# EAGLE design adapter (EAGLE 9.6.2)
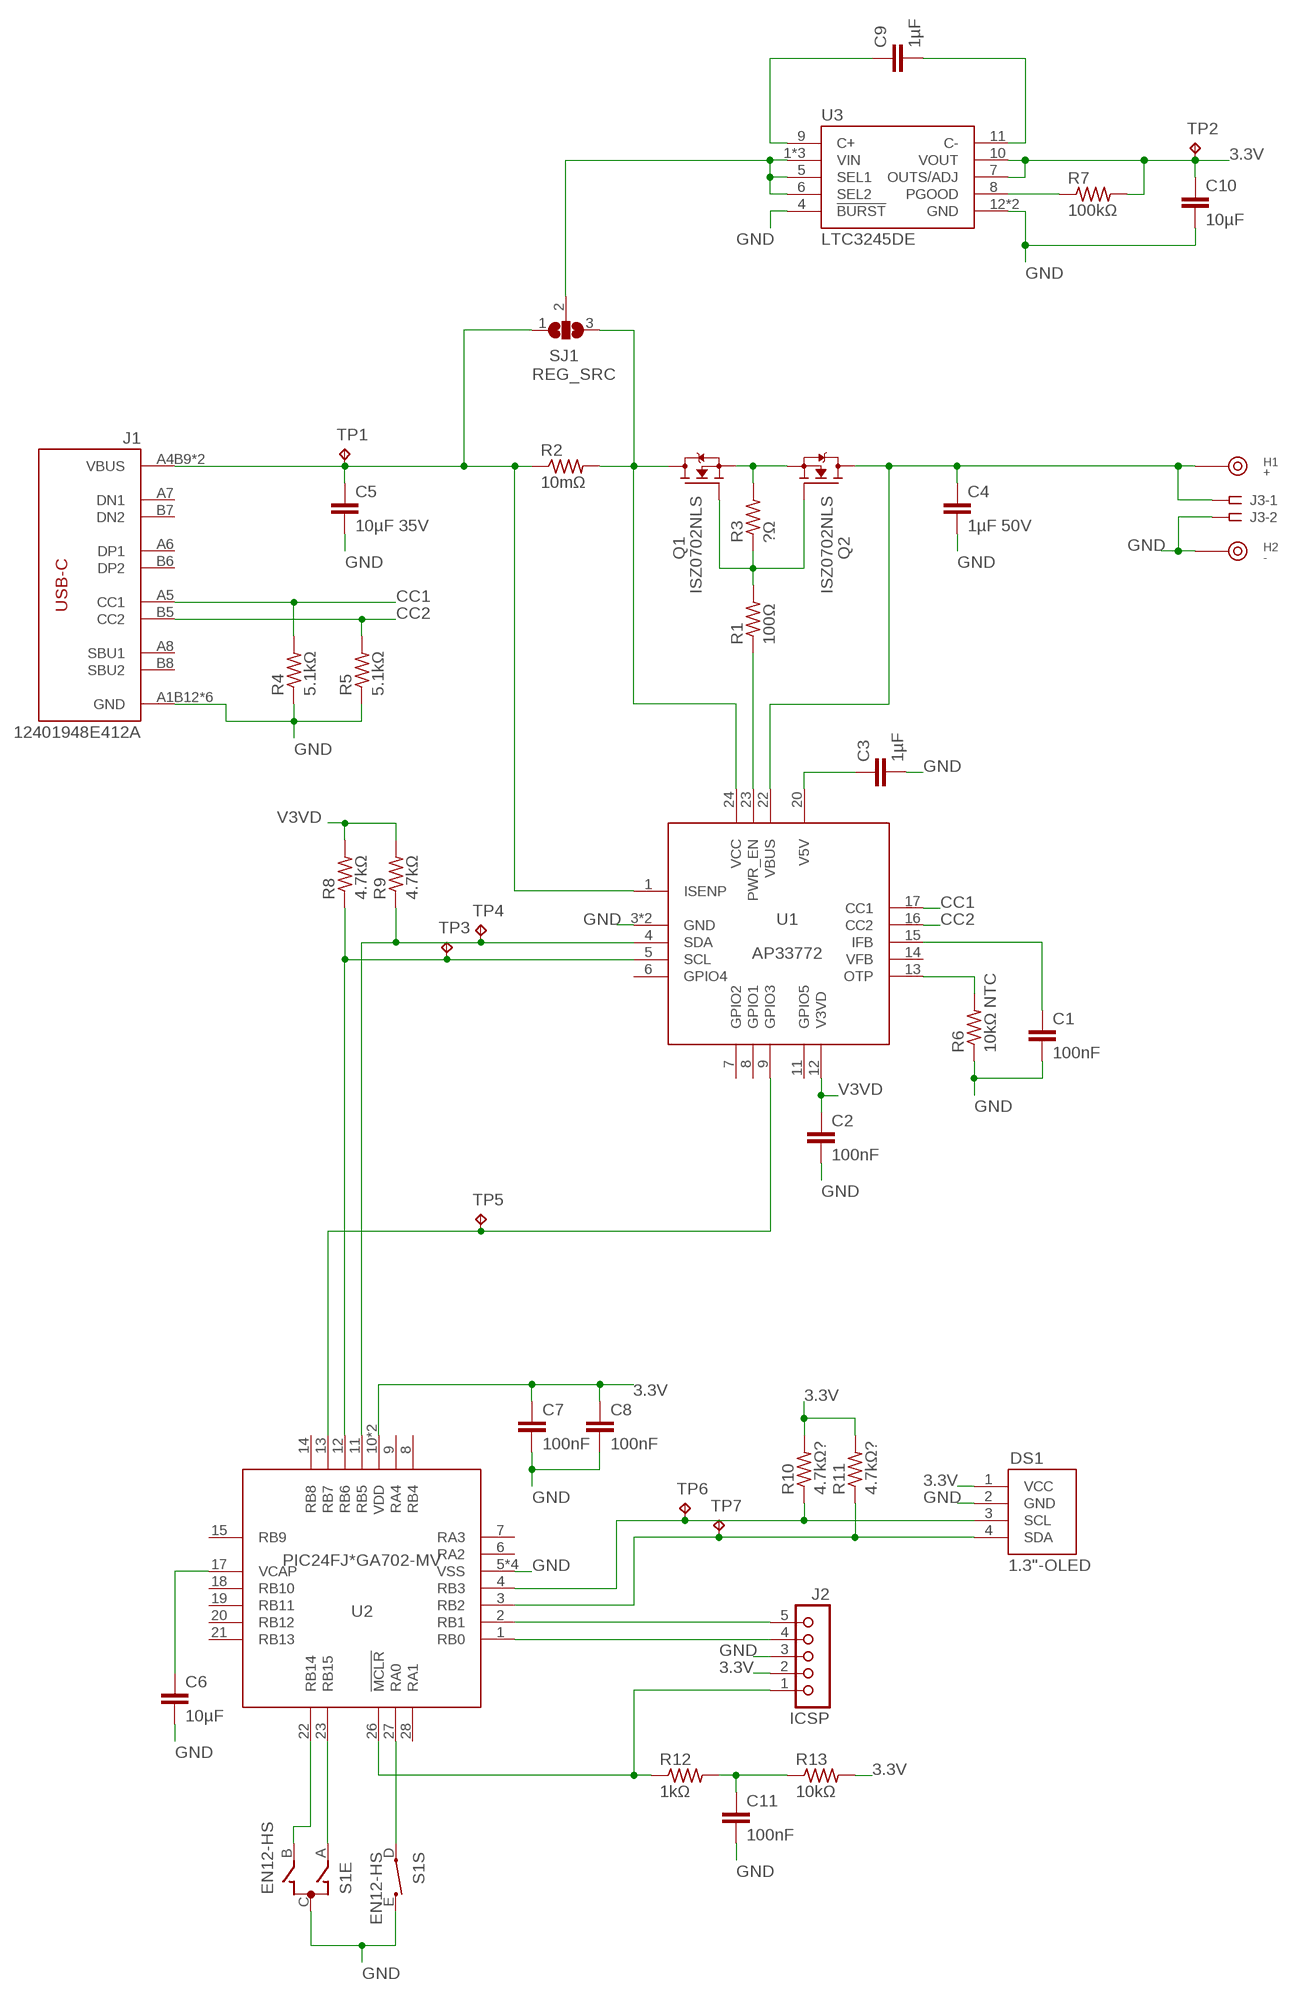
[diagram p0: schematic, sheet 1]

## Parts
C1  100nF  C-EUC0603  [C0603]
C2  100nF  C-EUC0603  [C0603]
C3  1µF  C-EUC0603  [C0603]
C4  1µF 50V  C-EUC0603  [C0603]
C5  10µF 35V  C-EUC1206  [C1206]
C6  10µF  C-EUC0805  [C0805]
C7  100nF  C-EUC0603  [C0603]
C8  100nF  C-EUC0603  [C0603]
C9  1µF  C-EUC0603  [C0603]
C10  10µF  C-EUC0805  [C0805]
C11  100nF  C-EUC0603  [C0603]
DS1  1.3"-OLED  [1.3"-OLED]
H1  +  78614015360  [78614015360]
H2  -  78614015360  [78614015360]
J1  12401948E412A  [12401948E412A]
J2  ICSP  5PIN-1.27  [5PIN-1.27]
J3  SSW-102-02-G-S-RA  [SSW-102-02-G-S-RA]
Q1  ISZ0702NLS  TSDSON-8-N-MOSFET  [TSDSON-8]
Q2  ISZ0702NLS  TSDSON-8-N-MOSFET  [TSDSON-8]
R1  100Ω  R-US_R0603  [R0603]
R2  10mΩ  R-US_R1206  [R1206]
R3  ?Ω  R-US_R0603  [R0603]
R4  5.1kΩ  R-US_R0603  [R0603]
R5  5.1kΩ  R-US_R0603  [R0603]
R6  10kΩ NTC  R-US_R0603  [R0603]
R7  100kΩ  R-US_R0603  [R0603]
R8  4.7kΩ  R-US_R0603  [R0603]
R9  4.7kΩ  R-US_R0603  [R0603]
R10  4.7kΩ?  R-US_R0603  [R0603]
R11  4.7kΩ?  R-US_R0603  [R0603]
R12  1kΩ  R-US_R0603  [R0603]
R13  10kΩ  R-US_R0603  [R0603]
S1  EN12-HS  [EN12-HS]
SJ1  REG_SRC  SJ2W  [SJ_2]
TP1  RCU-0(J)  [TP_0603_JOINED]
TP2  RCU-0(J)  [TP_0603_JOINED]
TP3  RCU-0(J)  [TP_0603_JOINED]
TP4  RCU-0(J)  [TP_0603_JOINED]
TP5  RCU-0(J)  [TP_0603_JOINED]
TP6  RCU-0(J)  [TP_0603_JOINED]
TP7  RCU-0(J)  [TP_0603_JOINED]
U1  AP33772  [QFN24-4X4]
U2  PIC24FJ*GA702-MV  [UQFN28_4X4MM]
U3  LTC3245DE  [DFN12]

## Nets
3.3V: C7.1 C8.1 C10.1 DS1.1(VCC) J2.2 R7.2 R10.2 R11.2 R13.2 TP2.1(TP) U2.10(VDD) U2.25(VDD) U3.7(OUTS/ADJ) U3.10(VOUT)
!MCLR: J2.1 R12.1 U2.26(!MCLR)
!MCLR!_FILTER: C11.1 R12.2 R13.1
C+: C9.1 U3.9(C+)
C-: C9.2 U3.11(C-)
CC1: J1.A5(CC1) R4.2 U1.17(CC1)
CC2: J1.B5(CC2) R5.2 U1.16(CC2)
ENC_A: S1.A(E:A) U2.23(RB15)
ENC_B: S1.B(E:B) U2.22(RB14)
ENC_SW: S1.D U2.27(RA0)
GND: C1.2 C2.2 C3.2 C4.2 C5.2 C6.2 C7.2 C8.2 C10.2 C11.2 DS1.2(GND) H2.M J1.A1B12(GND) J1.B1A12(GND) J1.M1(GND) J1.M2(GND) J1.M3(GND) J1.M4(GND) J2.3 J3.2 R4.1 R5.1 R6.1 S1.C(E:C) S1.E U1.3(GND) U1.EXP(GND) U2.5(VSS) U2.16(VSS) U2.24(VSS) U2.TH(VSS) U3.4(!BURST) U3.12(GND) U3.EXP(GND)
IFB: C1.1 U1.15(IFB)
OLED_SCL: DS1.3(SCL) R10.1 TP6.1(TP) U2.4(RB3)
OLED_SDA: DS1.4(SDA) R11.1 TP7.1(TP) U2.3(RB2)
OTP: R6.2 U1.13(OTP)
PGC: J2.5 U2.2(RB1)
PGD: J2.4 U2.1(RB0)
PWR_EN: R1.1 U1.23(PWR_EN)
PWR_EN_R: Q1.4(G) Q2.4(G) R1.2 R3.1
REG_PGOOD: R7.1 U3.8(PGOOD)
REG_VIN: SJ1.2 U3.1(VIN) U3.2(VIN) U3.3(VIN) U3.5(SEL1) U3.6(SEL2)
USB_INT: TP5.1(TP) U1.9(GPIO3) U2.13(RB7)
USB_SCL: R8.1 TP3.1(TP) U1.5(SCL) U2.12(RB6)
USB_SDA: R9.1 TP4.1(TP) U1.4(SDA) U2.11(RB5)
V3VD: C2.1 R8.2 R9.2 U1.12(V3VD)
V5V: C3.1 U1.20(V5V)
VBUS_IN: C5.1 J1.A4B9(VBUS) J1.B4A9(VBUS) R2.1 SJ1.1 TP1.1(TP) U1.1(ISENP)
VBUS_IN_R: Q1.5-8(D) R2.2 SJ1.3 U1.24(VCC)
VBUS_OUT: C4.1 H1.M J3.1 Q2.5-8(D) U1.22(VBUS)
VBUS_SW: Q1.1(S) Q1.2(S) Q1.3(S) Q2.1(S) Q2.2(S) Q2.3(S) R3.2
VCAP: C6.1 U2.17(VCAP)
Unconnected: J1.A6(DP1) J1.A7(DN1) J1.A8(SBU1) J1.B6(DP2) J1.B7(DN2) J1.B8(SBU2) U1.6(GPIO4) U1.7(GPIO2) U1.8(GPIO1) U1.11(GPIO5) U1.14(VFB) U2.6(RA2) U2.7(RA3) U2.8(RB4) U2.9(RA4) U2.14(RB8) U2.15(RB9) U2.18(RB10) U2.19(RB11) U2.20(RB12) U2.21(RB13) U2.28(RA1)

## Library data of the parts
C1-C11 = rcl:C-EU: CAPACITOR, European symbol; SPICEPREFIX: C
DS1 = BW-Active:1.3"-OLED
H1 H2 = BW-Connectors:78614015360: 1.5mm M3 threaded spacer or connector
J1 = BW-Connectors:12401948E412A: USB 2.0 Type C jack
J2 = BW-Connectors:5PIN-1.27: 5 pin header with 1.27mm pitch
J3 = con-samtec:SSW-102-02-G-S: THROUGH-HOLE .025" SQ POST SOCKET Source: Samtec SSW.pdf; MF: Samtec Inc.; MPN: SSW-102-02-G-S-RA; OC_FARNELL: unknown; OC_NEWARK: 11P9352
Q1 Q2 = BW-Active:TSDSON-8-N-MOSFET
R1-R13 = rcl:R-US_: RESISTOR, American symbol; SPICEPREFIX: R
S1 = BW-PassiveMechanical:EN12-HS: 12mm rotary encoder with switch
SJ1 = jumper:SJ2W: SMD solder JUMPER
TP1-TP7 = BW-PassiveMechanical:RCU-0: Solderable probe pad in 0603 form
U1 = BW-Active:AP33772: USB-C PD PPS Sink Controller
U2 = BW-Active:PIC24FJ*GA702: 16-bit Microcontroller, 16KB RAM, 28 pin
U3 = BW-Active:LTC3245: 250mA Buck-Boost Regulated Charge Pump

## Board
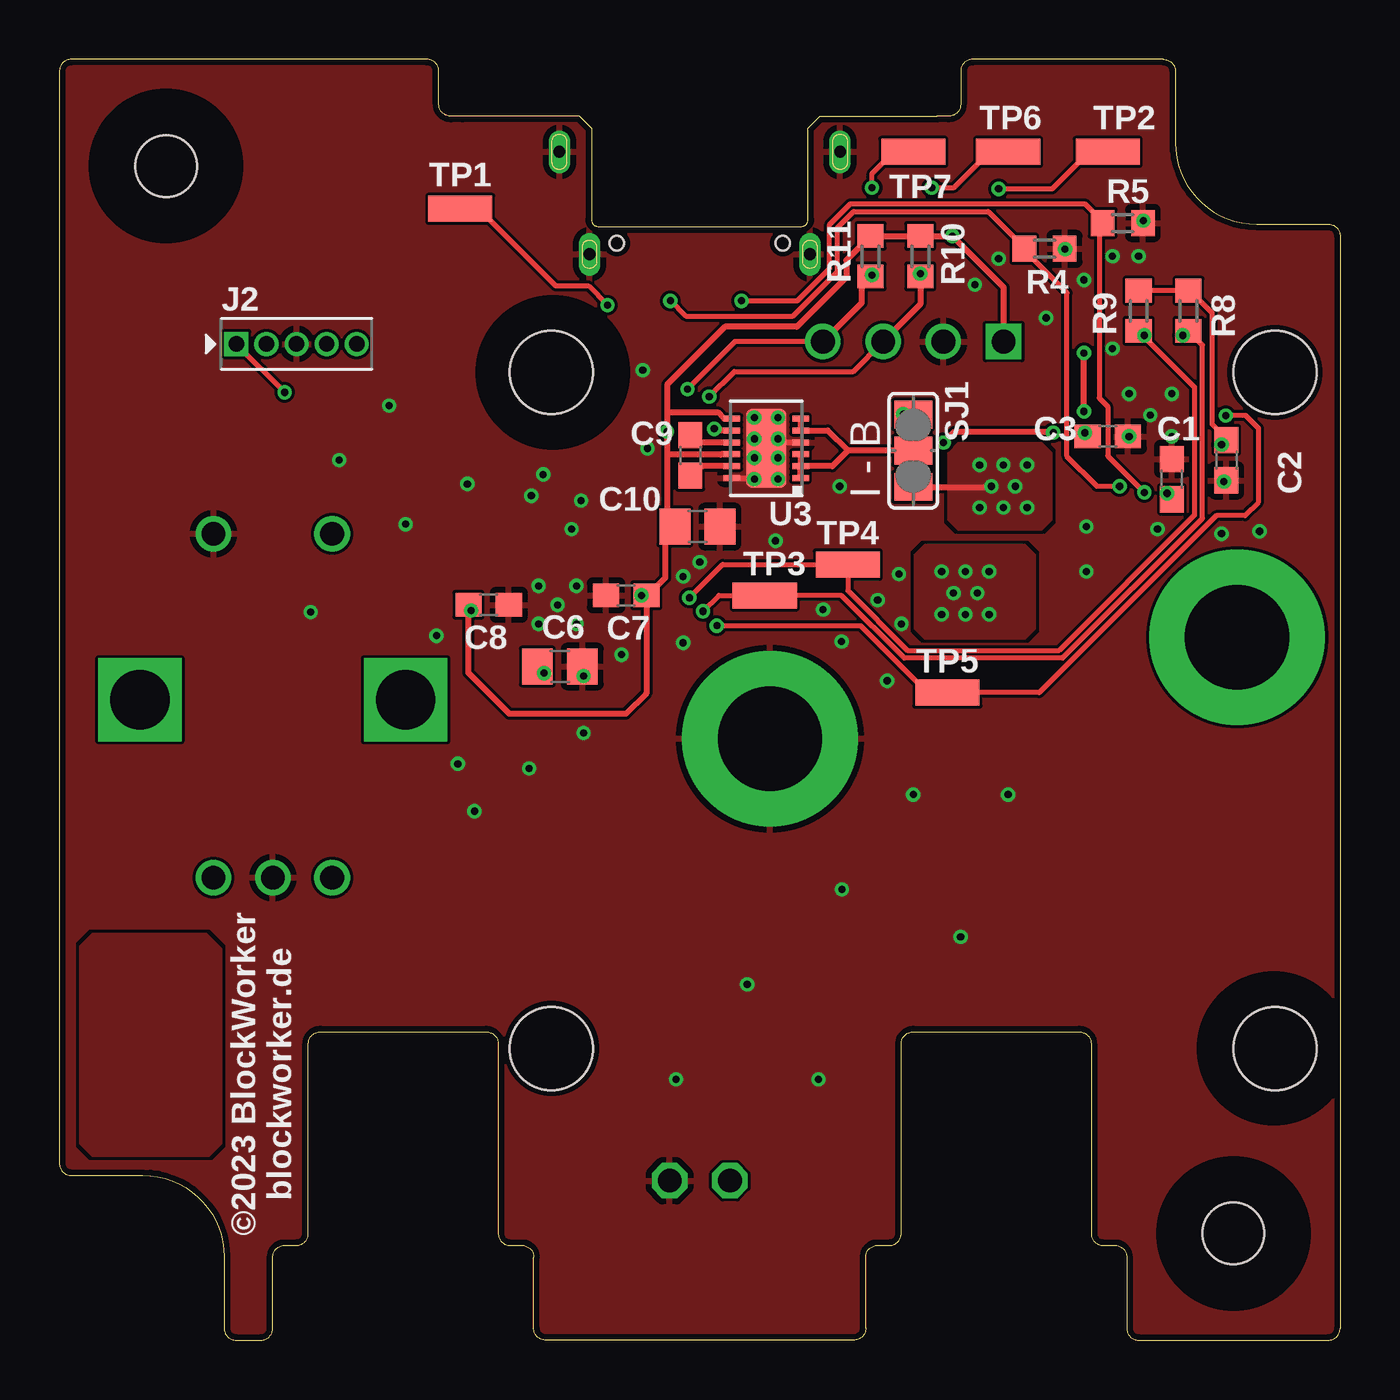
[diagram p1: board, top side]
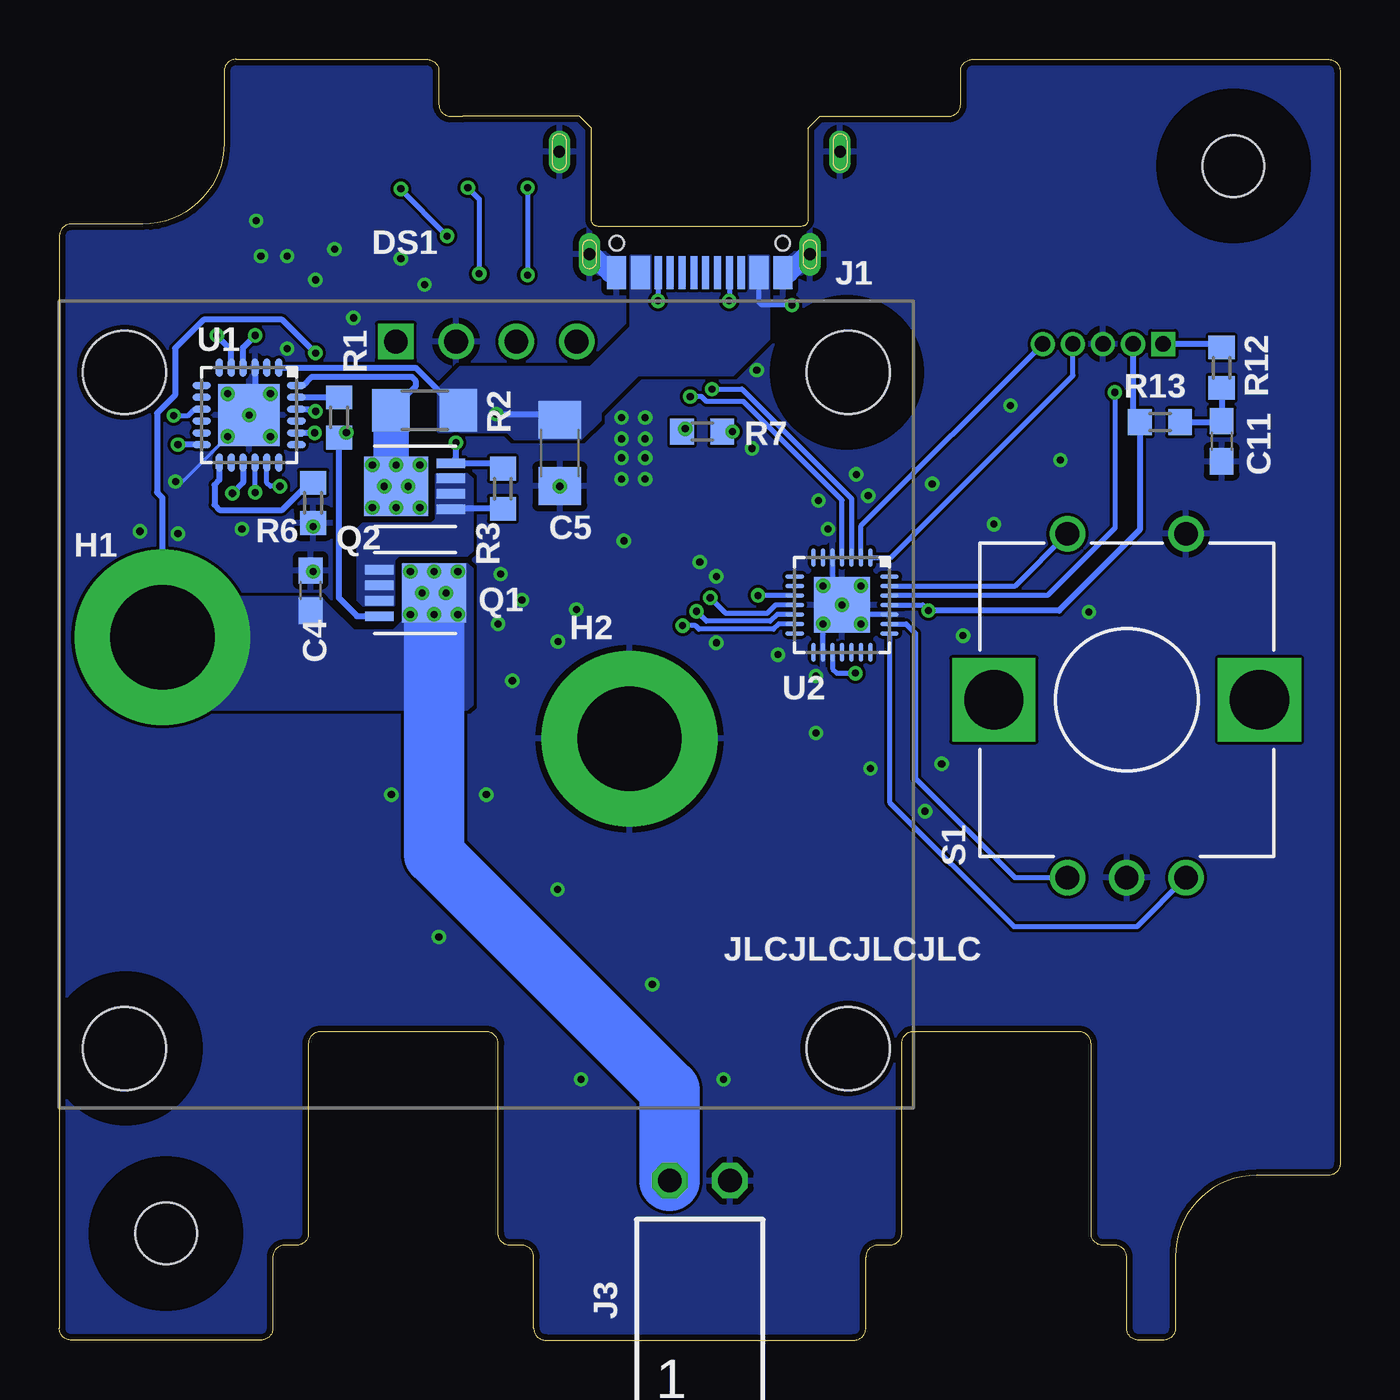
[diagram p2: board, bottom side, seen from below]

Size 54 x 54 mm. Coordinates in mm from the lower left corner, seen from the top.
Outline: 17,51.6 16.5,51.6 arc-90 16,52.1 16,53.5 arc90 15.5,54 0.5,54 arc90 0,53.5 0,7.45 arc90 0.5,6.95 3.52,6.95 arc-90 6.95,3.52 6.95,0.5 arc90 7.45,0 8.5,0 arc90 9,0.5 9,3.5 arc-90 9.5,4 10,4 arc90 10.5,4.5 10.5,12.5 arc-90 11,13 18,13 arc-90 18.5,12.5 18.5,4.5 arc90 19,4 19.5,4 arc-90 20,3.5 20,0.5 arc90 20.5,0 33.5,0 arc90 34,0.5 34,3.5 arc-90 34.5,4 35,4 arc90 35.5,4.5 35.5,12.5 arc-90 36,13 43,13 arc-90 43.5,12.5 43.5,4.5 arc90 44,4 44.5,4 arc-90 45,3.5 45,0.5 arc90 45.5,0 53.5,0 arc90 54,0.5 54,46.55 arc90 53.5,47.05 50.48,47.05 arc-90 47.05,50.48 47.05,53.5 arc90 46.55,54 38.5,54 arc90 38,53.5 38,52.1 arc-90 37.5,51.6 37,51.6
Copper layers (1*16): Top 0.035mm / dielectric 1.53mm / Bottom 0.035mm
Design rules "jlcpcb-2l": minimum track width 5mil, minimum drill 0.3mm, track to track 5mil, track to pad 5mil, pad to pad 5mil, via to via 5mil, smd to smd 0mil, copper to edge 0.25mm, drill to drill 0.5mm, minimum pad ring 0.15mm, minimum via ring 0.15mm, stop-mask expansion 4mil, vias tented up to drill 0.3mm, thermal gap 10mil
Holes 2.6 mm at 4.5,49.5 49.5,4.5
tKeepout: area 46.5,1.5 to 52.5,7.5; area 1.5,46.5 to 7.5,52.5; area 48.2,9.3 to 54.2,15.3; area 17.8,37.8 to 23.8,43.8
bKeepout: area 17.8,37.8 to 23.8,43.8; area 48.2,9.3 to 54.2,15.3; area 46.5,1.5 to 52.5,7.5; area 1.5,46.5 to 7.5,52.5
tRestrict: area 3,48 to 6,51; area 48,3 to 51,6; area 19.3,39.3 to 22.3,42.3; area 49.7,10.8 to 52.7,13.8
bRestrict: area 19.3,39.3 to 22.3,42.3; area 49.7,10.8 to 52.7,13.8; area 48,3 to 51,6; area 3,48 to 6,51

### Footprints (pad centres in the part's own frame; a part is rotated, then mirrored left to right if it is on the bottom)
C0603 = smd 1.1 x 1: 1 -0.85,0; 2 0.85,0
C1206 = smd 1.6 x 1.8: 1 -1.4,0; 2 1.4,0
C0805 = smd 1.3 x 1.5: 1 -0.95,0; 2 0.95,0
1.3"-OLED = drill 1 square: 1 -3.81,0 | drill 1: 2 -1.27,0; 3 1.27,0; 4 3.81,0 | hole 3.5: -15.25,-1.3; 15.25,-1.3; -15.25,-29.8; 15.25,-29.8
78614015360 = drill 4.4 pad 7.4: M 0,0
12401948E412A = smd 0.8 x 1.4: A1B12 -3.5,6.6; A4B9 -2.5,6.6; B1A12 3.5,6.6; B4A9 2.5,6.6 | smd 0.3 x 1.4: A5 -1.25,6.6; A6 -0.25,6.6; A7 0.25,6.6; A8 1.25,6.6; B5 1.75,6.6; B6 0.75,6.6; B7 -0.75,6.6; B8 -1.75,6.6 | drill 0.5 pad 0.9 long: M1 -5.92,1.5; M2 5.92,1.5; M3 -4.65,5.82; M4 4.65,5.82 | hole 0.6: -3.5,5.35; 3.5,5.35
5PIN-1.27 = drill 0.65 pad 1.016 square: 1 -2.54,0 | drill 0.65 pad 1.016: 2 -1.27,0; 3 0,0; 4 1.27,0; 5 2.54,0
SSW-102-02-G-S-RA = drill 1 pad 1.5 octagon: 1 -1.27,1.524; 2 1.27,1.524
TSDSON-8 = smd 1.2 x 0.4: 1 -1.5,0.975; 2 -1.5,0.325; 3 -1.5,-0.325; 4 -1.5,-0.975 | smd 2.7 x 2.5: 5-8 0.8,0
R0603 = smd 1 x 1.1: 1 -0.85,0; 2 0.85,0
R1206 = smd 1.6 x 1.803: 1 -1.422,0; 2 1.422,0
EN12-HS = drill 1: A -2.5,-7.5; B 2.5,-7.5; C 0,-7.5; D -2.5,7; E 2.5,7 | drill 2.5 square: M1 -5.6,0; M2 5.6,0
SJ_2 = smd 1.168 x 1.6: 1 -1.524,0; 2 0,0; 3 1.524,0
TP_0603_JOINED = smd 2.7 x 1.1: 1 0,0
QFN24-4X4 = smd 0.8 x 0.3: 1 -2,1.25; 2 -2,0.75; 3 -2,0.25; 4 -2,-0.25; 5 -2,-0.75; 6 -2,-1.25; 13 2,-1.25; 14 2,-0.75; 15 2,-0.25; 16 2,0.25; 17 2,0.75; 18 2,1.25 | smd 0.3 x 0.8: 7 -1.25,-2; 8 -0.75,-2; 9 -0.25,-2; 10 0.25,-2; 11 0.75,-2; 12 1.25,-2; 19 1.25,2; 20 0.75,2; 21 0.25,2; 22 -0.25,2; 23 -0.75,2; 24 -1.25,2 | smd 2.6 x 2.6: EXP 0,0
UQFN28_4X4MM = smd 0.8 x 0.2: 1 -2,1.2; 2 -2,0.8; 3 -2,0.4; 4 -2,0; 5 -2,-0.4; 6 -2,-0.8; 7 -2,-1.2; 15 2,-1.2; 16 2,-0.8; 17 2,-0.4; 18 2,0; 19 2,0.4; 20 2,0.8; 21 2,1.2 | smd 0.2 x 0.8: 8 -1.2,-2; 9 -0.8,-2; 10 -0.4,-2; 11 0,-2; 12 0.4,-2; 13 0.8,-2; 14 1.2,-2; 22 1.2,2; 23 0.8,2; 24 0.4,2; 25 0,2; 26 -0.4,2; 27 -0.8,2; 28 -1.2,2 | smd 2.35 x 2.35: TH 0,0
DFN12 = smd 0.25 x 0.7: 1 -1.25,-1.45; 2 -0.75,-1.45; 3 -0.25,-1.45; 4 0.25,-1.45; 5 0.75,-1.45; 6 1.25,-1.45; 7 1.25,1.45; 8 0.75,1.45; 9 0.25,1.45; 10 -0.25,1.45; 11 -0.75,1.45; 12 -1.25,1.45 | smd 3.3 x 1.7: EXP 0,0

### Placement (x,y rotation side)
C1  46.9,36.3 90 top
C2  49.2,37.1 270 top
C3  44.2,38.1 0 top
C4  43.4,31.6 90 bottom
C5  32.9,37.4 270 bottom
C6  21.1,28.4 0 top
C7  23.9,31.4 180 top
C8  18.1,31 0 top
C9  26.6,37.3 270 top
C10  26.9,34.3 0 top
C11  5,37.9 270 bottom
DS1  36,42.1 0 bottom
H1  49.66,29.64 0 bottom
H2  29.96,25.36 0 bottom
J1  27,51.6 180 bottom
J2  10,42 0 top
J3  27,5.2 0 bottom
Q1  39,36 180 bottom
Q2  39,31.5 0 bottom
R1  42.2,38.9 270 bottom
R2  38.6,39.2 180 bottom
R3  35.3,35.9 270 bottom
R4  41.53,46.01 180 top
R5  44.84,47.09 180 top
R6  43.3,35.3 90 bottom
R7  26.9,38.3 0 bottom
R8  47.6,43.4 90 top
R9  45.5,43.4 90 top
R10  36.3,45.7 90 top
R11  34.2,45.7 90 top
R12  5,41 270 bottom
R13  7.6,38.7 180 bottom
S1  9,27 0 bottom
SJ1  36,37.5 270 top
TP1  16.9,47.7 0 top
TP2  44.2,50.1 0 top
TP3  29.74,31.4 0 top
TP4  33.24,32.7 0 top
TP5  37.44,27.3 0 top
TP6  40,50.1 0 top
TP7  36,50.1 0 top
U1  46,39 270 bottom
U2  21,31 270 bottom
U3  29.8,37.6 90 top

### Tracks (layer width: path | path; a pad name or v marks a point on that pad's centre or on a via)
3.3V  (via drill 0.3)
  Top 0.203: C8.1 17.36,30.89 v17.36,30.76 | v24.54,31.4 C7.1 | v39.6,48.54 41.86,48.54 43.42,50.1 TP2.1
  Top 0.254: DS1.1 39.81,44.39 v37.65,46.55 R10.2 R11.2 33.18,45.53 33.18,44.81 31.09,42.72 28.06,42.72 25.62,40.28 25.62,39.12 | U3.10 27.91,37.35 27.89,37.33 25.62,37.33 | 25.62,37.33 25.62,34.63 C10.1 25.54,33.89 25.54,32.14 24.8,31.4 C7.1 24.75,27.27 23.88,26.4 18.98,26.4 17.25,28.13 C8.1 | U3.7 28.03,38.85 27.76,39.12 25.62,39.12 | 25.62,39.12 v25.62,38.3 25.62,37.33
  Bottom 0.203: U2.25 17.6,31 v17.36,30.76 | U2.10 v24.54,31.4 | v37.65,46.55 39.64,48.54 v39.6,48.54
  Bottom 0.254: J2.2 8.73,38.98 R13.2 8.45,34.17 11.86,30.76 v17.36,30.76 | v25.62,38.3 R7.2
!MCLR  (via drill 0.3)
  Top 0.203: J2.1 v9.5,39.96
  Bottom 0.203: v9.5,39.96 9.5,34.24 12.34,31.4 U2.26
  Bottom 0.254: R12.1 5.15,42 J2.1
!MCLR!_FILTER
  Bottom 0.254: R12.2 C11.1 5.05,38.7 R13.1
C+
  Top 0.254: U3.9 27.02,37.85 26.72,38.15 C9.1
C-
  Top 0.254: U3.11 27.1,36.85 26.7,36.45 C9.2
CC1  (via drill 0.3)
  Top 0.203: v25.76,43.82 26.4,43.18 30.94,43.18 32.8,45.04 32.8,46.9 33.48,47.58 39.16,47.58 40.68,46.06 R4.2 40.68,45.96 42.48,44.16 42.48,37.26 43.74,36 v44.7,36
  Bottom 0.203: J1.A5 v25.75,43.83 v25.76,43.82 | v44.7,36 45.1,36 45.25,36.15 U1.17
CC2  (via drill 0.3)
  Top 0.203: v28.76,43.82 31.11,43.82 32.47,45.18 32.47,47.04 33.34,47.91 43.23,47.91 43.98,47.15 R5.2 43.98,47.01 43.84,46.87 43.84,39.72 44.2,39.36 44.2,37.28 v45.74,35.74
  Bottom 0.203: J1.B5 v28.75,43.83 v28.76,43.82 | v45.74,35.74 U1.16
ENC_A
  Bottom 0.203: U2.23 18.3,30.2 17.9,29.8 17.9,23.68 13.72,19.5 S1.A
ENC_B
  Bottom 0.203: U2.22 19,22.68 13.76,17.44 8.56,17.44 S1.B
ENC_SW
  Bottom 0.203: U2.27 13.7,31.8 S1.D
GND  (via drill 0.3)
  Top 0.254: U3.12 29.25,36.35 v29.3,36.3 | U3.4 30.45,37.85 v30.3,38
  Bottom 0.152: U1.EXP 48.8,36.2 v49.1,36.2
  Bottom 0.203: U2.5 21.4,31.94 21.54,31.8 v21.8,31.8 | U2.24 20,30.6 20.2,30.4 v20.2,30.2 | U2.16 v21.8,30.2
  Bottom 0.254: U1.3 45.75,39.95 45.7,39.9 v45.1,39.9
  Bottom 0.813: J1.B1A12 30.78,45 31.56,45.78 J1.M4 | J1.A1B12 23.24,45 22.46,45.78 J1.M3
  other vias: 29.3,38.9 30.3,38.9 30.3,36.3 29.3,37.2 29.3,38 30.3,37.2 20.2,31.8 21,31 46.9,39.9 46.9,38.1 45.1,38.1 46,39 42.4,46 45.7,47.2 13.9,39.4 17.2,36.1 11.8,37.1 14.6,34.4 10.6,30.7 15.9,29.7 20.4,36.5 22,35.4 19.9,35.6 21.6,34.2 24.8,37.6 24.6,40.9 23.7,28.9 26.3,29.4 27,32.8 26.3,32.2 32.9,36 45.5,45.7 50.6,34.1 49,34 46.3,34.2 43.3,34.3 43.3,32.4 35.4,32.3 34.5,31.2 32.98,29.46 34.9,27.8 35.5,30.2 32.2,30.8 30.2,33.7 44.4,45.7 44.4,41.8 17.5,22.3 19.8,24.1 16.8,24.3 22.1,28 22.1,25.6 36,23 40,23 33,19 38,17 29,15 32,11 26,11 41.6,43.1 43.2,44.7 39.6,45.6 38.6,44.5
  pour Bottom (rank 6): -1,54 0,55 54,55 55,54 55,0 54,-1 0,-1 -1,0
  pour Top (rank 6): -1,54 0,55 54,55 55,54 55,0 54,-1 0,-1 -1,0
  pour Top (no thermals): 28.4,39.5 28.4,35.7 31.2,35.7 31.2,39.5
IFB  (via drill 0.3)
  Top 0.254: v46.7,35.7 46.7,35.65 C1.1
  Bottom 0.254: U1.15 46.25,36.15 v46.7,35.7
LOGO
  pour Top: 0.9,16.6 1.4,17.1 6.2,17.1 6.8,16.5 6.8,8.3 6.3,7.8 1.4,7.8 0.9,8.3
OLED_SCL  (via drill 0.3)
  Top 0.203: v27.4,39.78 28.46,40.84 33.47,40.84 DS1.3 | R10.1 36.35,44.9 v36.3,44.96 | v36.78,48.59 37.72,48.59 39.23,50.1 TP6.1
  Top 0.254: R10.1 36.3,43.67 DS1.3
  Bottom 0.203: U2.4 21,35.41 25.16,39.57 26.72,39.57 26.93,39.78 v27.4,39.78 | v36.78,48.59 36.3,48.11 v36.3,44.96
OLED_SDA  (via drill 0.3)
  Top 0.203: DS1.4 28.48,42.1 v26.48,40.1 | R11.1 v34.26,44.91 v34.27,44.91 | v34.27,48.59 34.27,49.18 35.19,50.1 TP7.1
  Top 0.254: R11.1 33.82,44.47 33.82,43.73 DS1.4
  Bottom 0.203: v26.48,40.1 25.22,40.1 20.6,35.48 U2.3 | v34.27,48.59 v34.27,44.91
OTP
  Bottom 0.254: U1.13 47.25,36.27 47.46,36.06 47.46,35.22 47.24,35 44.6,35 43.61,35.99 43.46,35.99 R6.2
PGC
  Bottom 0.203: U2.2 20.2,34.34 J2.5
PGD
  Bottom 0.203: U2.1 18.94,33 11.27,40.67 J2.4
PWR_EN
  Bottom 0.254: U1.23 R1.1
PWR_EN_R  (via drill 0.3)
  Top 0.254: v37.28,37.84 37.74,38.3 41.86,38.3 v41.9,38.26
  Bottom 0.254: Q2.4 41.45,30.52 42.22,31.3 42.22,38.03 R1.2 41.99,38.26 v41.9,38.26 | R3.1 35.52,36.98 Q1.4 37.28,37.2 v37.28,37.84
REG_PGOOD  (via drill 0.3)
  Top 0.254: U3.8 27.69,38.35 v27.61,38.42
  Bottom 0.254: R7.1 27.74,38.3 v27.61,38.42
REG_VIN
  Top 0.254: SJ1.2 33.24,37.5 | U3.2 32.59,36.85 33.24,37.5 | U3.3 U3.2 | U3.1 U3.2 | 33.24,37.5 32.39,38.35 U3.5 U3.6
USB_INT  (via drill 0.3)
  Top 0.203: v27.72,30.12 33.78,30.12 36.61,27.3 TP5.1 41.31,27.3 48.77,34.76 49.98,34.76 50.56,35.34 50.56,38.44 50.02,38.98 v49.18,38.98
  Bottom 0.203: U2.13 23.67,30.2 23.89,29.98 27.04,29.98 27.18,30.12 v27.72,30.12 | v49.18,38.98 48.56,38.98 48.29,39.25 U1.9
USB_SCL  (via drill 0.3)
  Top 0.203: R8.1 48.19,41.96 48.19,34.64 42.3,28.75 35.62,28.75 32.97,31.4 TP3.1 27.81,31.4 v27.14,30.73
  Top 0.254: v47.36,42.36 47.55,42.55 R8.1
  Bottom 0.203: U2.12 23.73,30.6 24.02,30.31 26.72,30.31 v27.14,30.73
  Bottom 0.254: U1.5 46.75,41.75 v47.36,42.36
USB_SDA  (via drill 0.3)
  Top 0.203: R9.1 47.86,40.19 47.86,34.78 42.16,29.08 35.76,29.08 33.24,31.6 TP4.1 27.96,32.7 v26.56,31.3
  Top 0.254: v45.74,42.36 45.55,42.55 R9.1
  Bottom 0.203: v26.56,31.3 25.9,30.64 24.16,30.64 23.8,31 U2.11
  Bottom 0.254: U1.4 46.25,41.85 v45.74,42.36
V3VD  (via drill 0.3)
  Top 0.203: C2.1 49.2,38.02 48.6,38.62 48.6,43.3 47.65,44.25 R8.2 R9.2
  Top 0.254: v49,37.76 C2.1
  Bottom 0.254: U1.12 v48.99,37.75 v49,37.76
V5V  (via drill 0.3)
  Top 0.254: v43.24,38.25 43.35,38.14 C3.1
  Bottom 0.254: U1.20 v43.24,38.25
VBUS_IN  (via drill 0.3)
  Top 0.203: TP1.1 17.68,47.7 20.93,44.45 22.3,44.45 v23.11,43.64
  Top 0.254: SJ1.1 35.6,39.02 v35.58,39.04
  Bottom 0.203: v23.11,43.64 24.38,43.64 24.5,43.75 J1.A4B9
  Bottom 0.254: U1.1 38.98,41 R2.1 | v35.58,39.04 33.14,39.04 C5.1
  pour Bottom (no thermals): 38,38.3 35.1,38.3 34.8,38 32,38 31.2,38.8 31.2,39.1 29.6,40.7 27.8,40.7 25.6,40.7 24.9,41.4 24.1,42.2 24.1,44.3 24.1,45.7 29.9,45.7 29.9,42.7 31.3,41.3 31.6,41 33.5,41 37.1,41 38,40.1
VBUS_IN_R  (via drill 0.3)
  Top 0.254: SJ1.3 39.28,35.98 v39.3,36
  Bottom 0.203: Q1.5-8 v39.3,36
  Bottom 0.254: U1.24 43.73,40.25 43.36,40.62 39.14,40.62 38.98,40.46 38.98,40.2 39.98,39.2 R2.2
  Bottom 1.5: R2.2 40.02,36.22 Q1.5-8
  other vias: 38.8,36.9 38.8,35.1 40.8,36.9 40.8,35.1 40.3,36 39.8,35.1 39.8,36.9
  pour Top (no thermals): 37.5,37.4 37.5,34.6 37.9,34.2 41.4,34.2 41.8,34.6 41.8,37.4 41.4,37.8 37.9,37.8
VBUS_OUT  (via drill 0.3)
  Top 0.254: v43.2,39.16 v43.2,41.62
  Bottom 0.254: U1.22 43.5,39.25 43.41,39.16 v43.2,39.16 | v43.2,41.62 44.6,43.02 47.92,43.02 49.12,41.82 49.12,39.84 49.88,39.08 49.88,35.74 49.66,35.52 H1.M
  Bottom 2.54: Q2.5-8 38.2,20.48 28.27,10.55 J3.1
  other vias: 37.2,32.4 38.2,32.4 39.2,32.4 37.2,30.6 38.2,30.6 39.2,30.6 38.7,31.5 37.7,31.5
  pour Bottom (no thermals): 36.9,32.7 36.8,32.7 36.6,32.5 36.6,26.8 36.8,26.6 48.1,26.6 48.3,26.8 48.3,30.6 47.6,31.3 43,31.3 42.7,31 41.6,29.9 40,29.9 39.9,29.9 39.5,30.3 39.5,32.7
  pour Top (no thermals): 36.5,33.5 36.1,33.1 36.1,32.9 36.1,30 36.5,29.6 40.7,29.6 41.1,30 41.1,33.1 40.7,33.5
VBUS_SW
  Bottom 0.254: R3.2 37.48,35.05 Q1.1
  pour Bottom (no thermals): 38.1,36.5 36.8,36.5 36.6,36.3 36.6,33.3 36.8,33.1 39.7,33.1 39.8,33 39.9,32.9 39.9,31 41.2,31 41.4,31.2 41.4,34.2 41.2,34.4 38.3,34.4 38.1,34.6
VCAP  (via drill 0.3)
  Top 0.203: v20.44,28.12 v20.43,28.12 C6.1
  Bottom 0.203: U2.17 21.4,28.3 21.22,28.12 v20.44,28.12

### Text on the board
tPlace: I - B | ©2023 BlockWorker / blockworker.de
bPlace: JLCJLCJLCJLC